# EasyEDA Pro project CAN2RPM-4layer.epro

# Schematic untitled
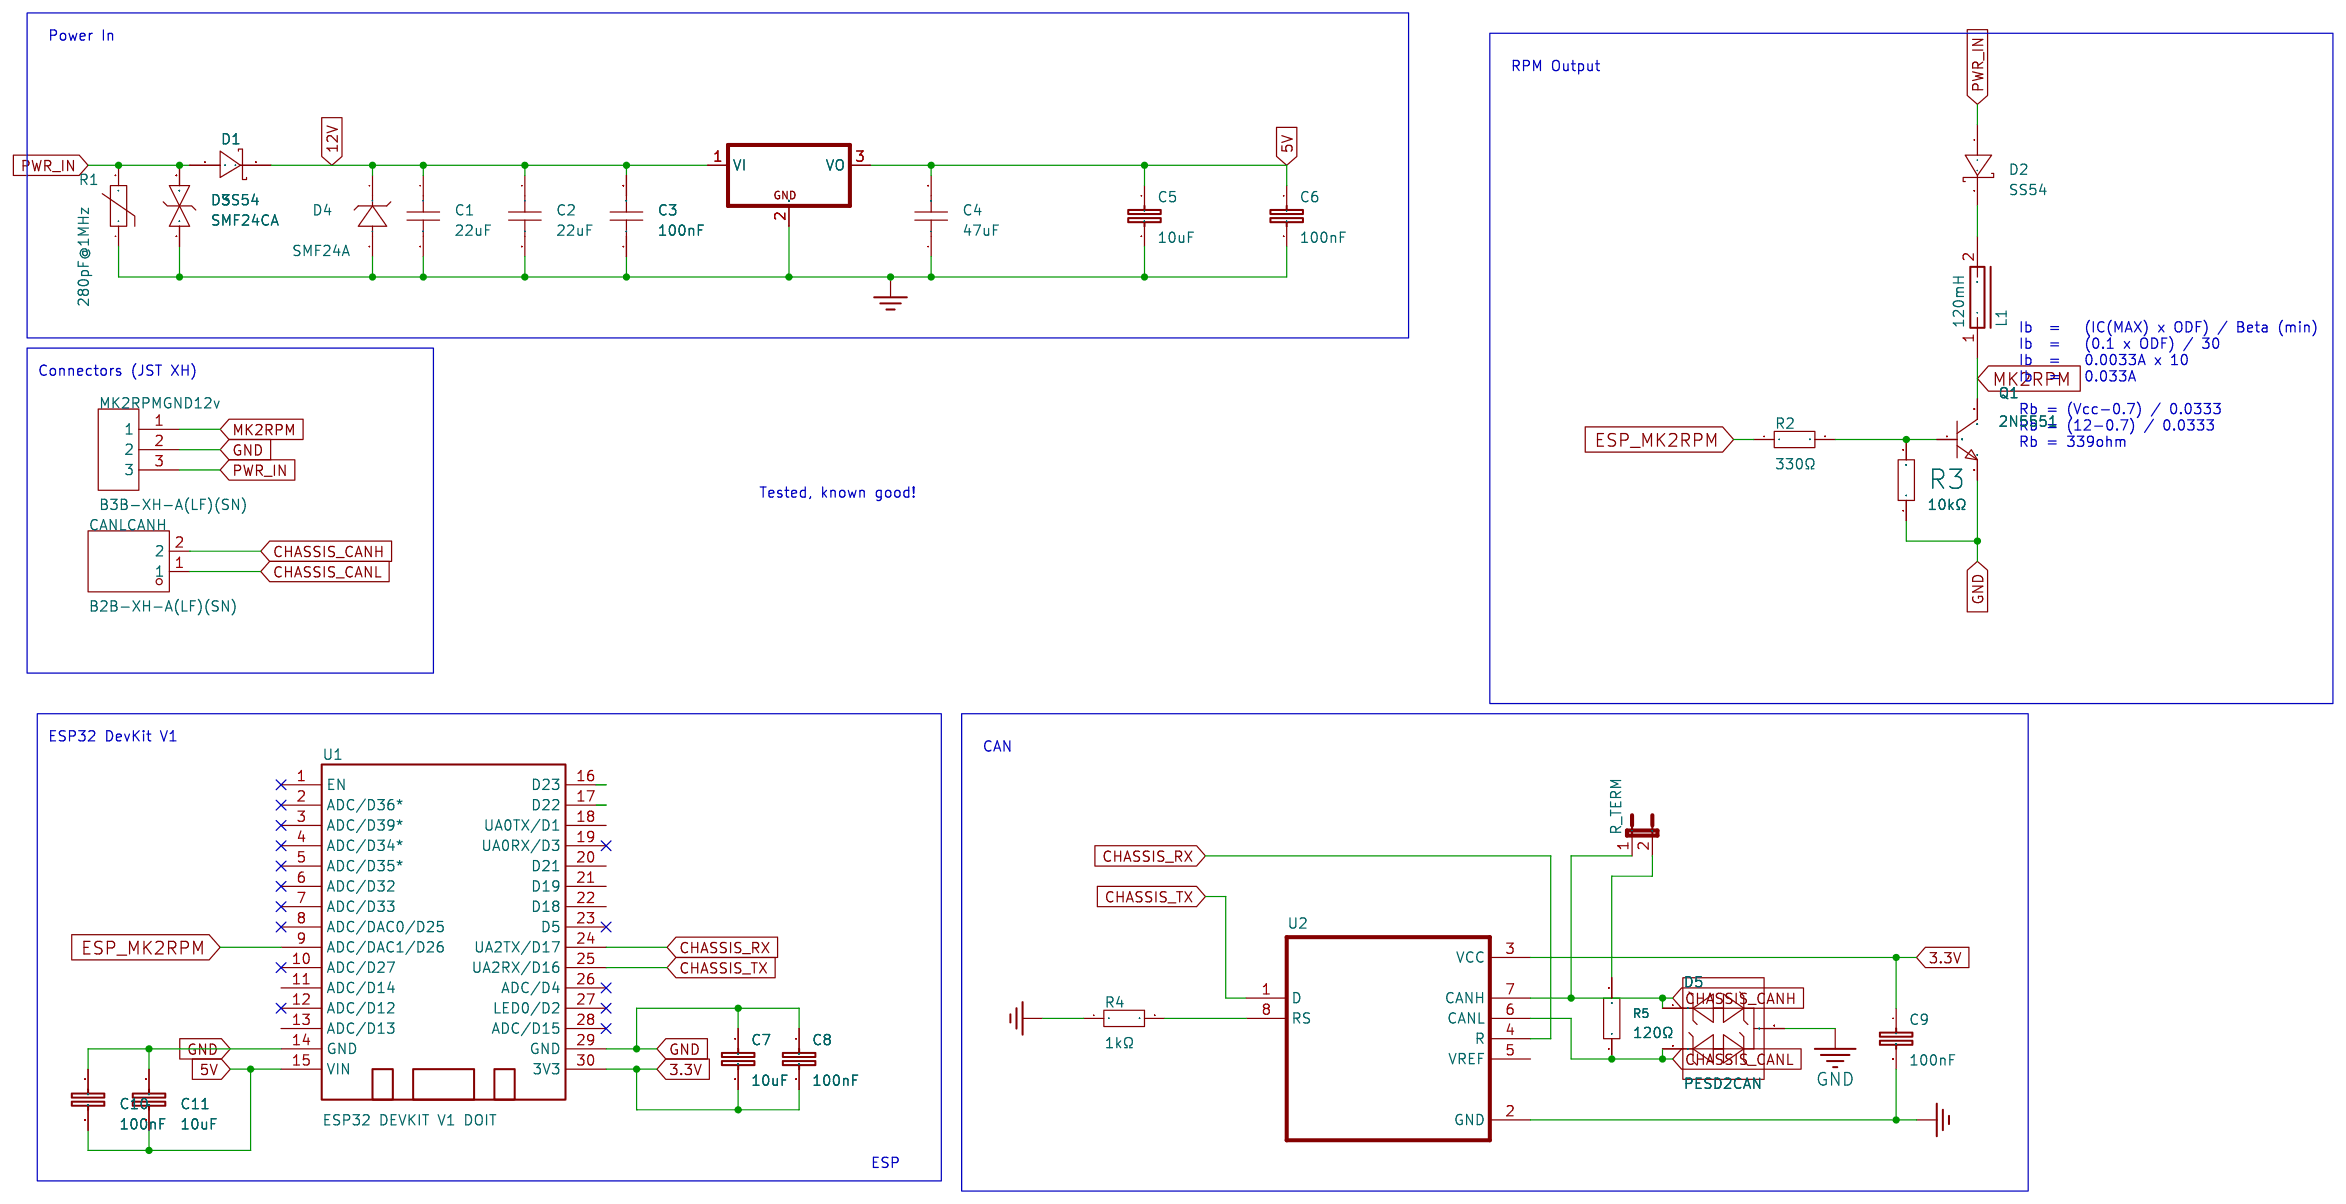
[diagram p0: schematic sheet]

## Parts
C1  22uF  [C0805]
C2  22uF  [C0805]
C3  100nF  [C0603]
C4  47uF  [C0805]
C5  10uF  [C0805]
C6  100nF  [C0805]
C7  10uF  [C0805]
C8  100nF  [C0603]
C9  100nF  [C0805]
C10  100nF  [C0603]
C11  10uF  [C0805]
CANLCANH  B2B-XH-A(LF)(SN)  [CONN-TH_B2B-XH-A-LF-SN]
D1  SS54  [SMA_L4.4-W2.8-LS5.4-R-RD]
D2  SS54  [SMA_L4.4-W2.8-LS5.4-R-RD]
D3  SMF24CA  [SOD-123FL_L2.8-W1.8-LS3.7-BI]
D4  SMF24A  [SOD-123FL_L2.7-W1.8-LS3.8-RD]
D5  PESD2CAN  [SOT-23-3_L2.9-W1.3-P1.90-LS2.4-BR]
IC1  L7805ABD2T-TR  [TO-263-2_L10.0-W9.2-P5.08-LS15.3-TL-CW]
L1  120mH  [IND-SMD_L12.5-W12.5]
MK2RPMGND12v  B3B-XH-A(LF)(SN)  [CONN-TH_3P-P2.50_A2501WV2-3P]
Q1  2N5551  [SOT-23-3_L2.9-W1.4-P1.90-LS2.5-BR]
R1  280pF@1MHz  [R0805]
R2  330Ω  [R0603]
R3  10kΩ  [R0603]
R4  1kΩ  [R0603]
R5  120Ω  [R0603]
R_TERM  PZ254V-11-02P  [HDR-TH_2P-P2.54-V-M]
U1  ESP32 DEVKIT V1 DOIT  [DOIT-ESP32-DEVKIT-V1]
U2  SN65HVD230DR  [SOIC-8_L4.9-W3.9-P1.27-LS6.0-BL]

## Library data of the parts
C1 C2 = HGC0805R5226M350NSLJ: Capacitance: Tolerance:±20% Tolerance:±20% Voltage Rated: Temperature Coefficient:; LCSC Part Name: 22uF ±20% 35V; Supplier Part: C22367832; Manufacturer: Chinocera(华瓷); Supplier Footprint: 0805; JLCPCB Part Class: Extended Part; Datasheet: https://atta.szlcsc.com/upload/public/pdf/source/20240326/E9E9157D170E907C889ABA1F54A94302.pdf; Supplier: LCSC; Tolerance: ±20%; Standardization Check: false
C3 = CL10B104KB8NNNC: Capacitance:100nF Tolerance:±10% Tolerance:±10% Voltage Rating:50V Temperature Coefficient:X7R; LCSC Part Name: 100nF ±10% 50V; Supplier Part: C1591; Manufacturer: SAMSUNG(三星); Supplier Footprint: 0603; JLCPCB Part Class: Extended Part; Datasheet: https://item.szlcsc.com/datasheet/CL10B104KB8NNNC/1943.html; Supplier: LCSC; Tolerance: ±10%; Voltage Rating: 50V; Temperature Coefficient: X7R
C4 = CL21A476MPYNNWE: Capacitance:47uF Tolerance:±20% Tolerance:±20% Voltage Rating:10V Temperature Coefficient:X5R; LCSC Part Name: 47uF ±20% 10V; Supplier Part: C5596752; Manufacturer: SAMSUNG(三星); Supplier Footprint: 0805; JLCPCB Part Class: Extended Part; Datasheet: https://item.szlcsc.com/datasheet/CL21A476MPYNNWE/6515219.html; Supplier: LCSC; Tolerance: ±20%; Voltage Rating: 10V; Temperature Coefficient: X5R
C5 C7 C11 = CL21A106KAYNNNE_C15850: Capacitance: Tolerance:±10% Tolerance:±10% Voltage Rated: Temperature Coefficient:; LCSC Part Name: 10uF ±10% 25V; Supplier Part: C15850; Manufacturer: SAMSUNG(三星); Manufacturer Part: CL21A106KAYNNNE; Supplier Footprint: 0805; JLCPCB Part Class: Basic Part; Datasheet: https://atta.szlcsc.com/upload/public/pdf/source/20160218/1457707763339.pdf; Supplier: LCSC; Tolerance: ±10%
C6 C9 = CT41G-0805-2X1-50V-0.1μF-K(N): Capacitance:100nF Tolerance:±10% Tolerance:±10% Voltage Rating:50V Temperature Coefficient:-; LCSC Part Name: 100nF ±10% 50V; Supplier Part: C126469; Manufacturer: TORCH(火炬); Supplier Footprint: 0805; JLCPCB Part Class: Extended Part; Datasheet: https://atta.szlcsc.com/upload/public/pdf/source/20171225/C150708_15141883600121203188.pdf; Supplier: LCSC; Tolerance: ±10%; Voltage Rating: 50V
C8 C10 = CC0603KRX7R9BB104: Capacitance:100nF Tolerance:±10% Tolerance:±10% Voltage Rating:50V Temperature Coefficient:X7R; LCSC Part Name: 100nF ±10% 50V; Supplier Part: C14663; Manufacturer: YAGEO(国巨); Supplier Footprint: 0603; JLCPCB Part Class: Basic Part; Datasheet: https://atta.szlcsc.com/upload/public/pdf/source/20250214/096C4C206003071F5D32E5F0D8E7F8DF.pdf; Supplier: LCSC; Tolerance: ±10%; Voltage Rating: 50V; Temperature Coefficient: X7R
CANLCANH = B2B-XH-A(LF)(SN): Pins Structure:1x2P Pitch:2.5mm Mounting Style:Direct Insert Reference Series:XH Number of Pins:2P Number of Rows:1 Number of PINs Per Row:2 Row Spacing:- Current Rating (Max):3A Contact Material:Brass Contact Plating:Tin Operating Temperature Range:-25℃~; LCSC Part Name: 1x2P 间距:2.5mm 直插 系列:XH; Supplier Part: C158012; Manufacturer: JST; Supplier Footprint: 插件,P=2.5mm; JLCPCB Part Class: Extended Part; Datasheet: https://atta.szlcsc.com/upload/public/pdf/source/20180928/C265283_F9DFEEBDB2CF642B6BDFAB4B77BD2680.pdf; Supplier: LCSC; Pins Structure: 1x2P; Pitch: 2.5mm; Mounting Style: Direct Insert; Reference Series: XH; Number of Pins: 2P; Number of Rows: 1; Number of PINs Per Row: 2; Current Rating (Max): 3A; Contact Material: Brass; Contact Plating: Tin; Operating Temperature Range: -25℃~+85℃; Rated Voltage (Max): 250V; Plastic Material: PA66; Flame Retardant Rating: UL94V-0; Supplementary Features: K-leg punch; Colour: White; Z-Height of the Board: 7mm; X-Length of Bottom Edge on Board (Spacing Line): 7.4mm; Y-Width of Bottom Edge on Board: 5.75mm
D1 D2 = SS54_C22452: Diode Configuration:Independent Type Forward Voltage (Vf@If):550mV@5A Reverse Voltage (Vr):40V Rectified Current:5A Reverse Leakage Current (Ir):1mA@40V; LCSC Part Name: 电压:40V 电流:5A; Supplier Part: C22452; Manufacturer: MDD(辰达半导体); Supplier Footprint: SMA(DO-214AC); JLCPCB Part Class: Basic Part; Datasheet: https://atta.szlcsc.com/upload/public/pdf/source/20240710/73DFBB65C1883B895E62D589679033DF.pdf; Supplier: LCSC; Diode Configuration: Independent Type; Forward Voltage (Vf@If): 550mV@5A; Reverse Voltage (Vr): 40V; Rectified Current: 5A; Reverse Leakage Current (Ir): 1mA@40V
D3 = SMF24CA_C353294: Reverse Stand-Off Voltage (Vrwm):24V Maximum Clamping Voltage:38.9V Peak Pulse Current (Ipp)@10/1000us:5.1A Breakdown Voltage:26.7V Reverse Leakage Current (Ir):1uA Type:TVS; Supplier Part: C353294; Manufacturer: 晶导微电子; Supplier Footprint: SOD-123FL; JLCPCB Part Class: Extended Part; Datasheet: https://atta.szlcsc.com/upload/public/pdf/source/20201106/C438024_76561727B84E8C9F41A4B4461A8AA838.pdf; Supplier: LCSC; Reverse Stand-Off Voltage (Vrwm): 24V; Maximum Clamping Voltage: 38.9V; Peak Pulse Current (Ipp)@10/1000us: 5.1A; Breakdown Voltage: 26.7V; Reverse Leakage Current (Ir): 1uA; Type: TVS
D4 = SMF24A_C19077514: Polarity:Unidirectional Reverse Stand-Off Voltage (Vrwm):24V Clamping Voltage:38.9V Peak Pulse Current (Ipp):5.1A@10/1000us Peak Pulse Power Dissipation (Ppp):200W@10/1000us Voltage - Breakdown:29.5V Reverse Leakage Current (Ir):1uA Number of Channels:1.0; LCSC Part Name: 单向TVS 24V截止 峰值浪涌电流：5.1A@10/1000us; Supplier Part: C19077514; Manufacturer: R+O(宏嘉诚); Supplier Footprint: SOD-123FL; JLCPCB Part Class: Extended Part; Datasheet: https://item.szlcsc.com/datasheet/SMF24A/20275599.html; Supplier: LCSC; Polarity: Unidirectional; Reverse Stand-Off Voltage (Vrwm): 24V; Clamping Voltage: 38.9V; Peak Pulse Current (Ipp): 5.1A@10/1000us; Peak Pulse Power Dissipation (Ppp): 200W@10/1000us; Voltage - Breakdown: 29.5V; Reverse Leakage Current (Ir): 1uA; Number of Channels: 1; Operating Temperature: -55℃~+150℃; level of protection: IEC 61000-4-2; Type: TVS
D5 = PESD2CAN_C907830: Polarity:Bidirectional Reverse Stand-Off Voltage (Vrwm):24V Clamping Voltage:50V Peak Pulse Current (Ipp):5.5A@8/20us Peak Pulse Power Dissipation (Ppp):250W@8/20us Voltage - Breakdown:32V Reverse Leakage Current (Ir):80nA Number of Channels:2 Operating T; LCSC Part Name: 丝印为6Rt 双向ESD 24V截止 峰值浪涌电流：5.5A@8/20us; Supplier Part: C907830; Manufacturer: TECH PUBLIC(台舟); Supplier Footprint: SOT-23; JLCPCB Part Class: Extended Part; Datasheet: https://item.szlcsc.com/datasheet/PESD2CAN/973917.html; Supplier: LCSC; Polarity: Bidirectional; Reverse Stand-Off Voltage (Vrwm): 24V; Clamping Voltage: 50V; Peak Pulse Current (Ipp): 5.5A@8/20us; Peak Pulse Power Dissipation (Ppp): 250W@8/20us; Voltage - Breakdown: 32V; Reverse Leakage Current (Ir): 80nA; Number of Channels: 2; Operating Temperature: -55℃~+125℃; level of protection: IEC 61000-4-2；IEC 61000-4-4；IEC 61000-4-5; Type: ESD; Junction Capacitance: 17pF
IC1 = L7805ABD2T-TR: Output Type:Fixed Maximum Input Voltage:35V Output Voltage:5V Output Voltage:5V Output Current:1.5A Power Supply Rejection Ratio (PSRR):68dB@(120Hz) Dropout Voltage:2V@(1A) standby current:6mA Feature:Short-Circuit  Protection；Thermal Protection(TSD) Oper; LCSC Part Name: 正稳压器IC; Supplier Part: C86206; Manufacturer: ST(意法半导体); Supplier Footprint: TO-263-2; JLCPCB Part Class: Extended Part; Datasheet: https://atta.szlcsc.com/upload/public/pdf/source/20191219/C472632_C0855675BBC73B8C8E44EE1325AAD56A.pdf; Supplier: LCSC; Output Type: Fixed; Maximum Input Voltage: 35V; Output Voltage: 5V; Output Current: 1.5A; Power Supply Rejection Ratio (PSRR): 68dB@(120Hz); Dropout Voltage: 2V@(1A); standby current: 6mA; Feature: Short-Circuit  Protection；Thermal Protection(TSD); Operating Temperature: -40℃~+125℃; Output Polarity: Positive electrode; Number of Outputs: 1
L1 = DR125-124-R: Inductance:120mH Tolerance:±20% Tolerance:±20% Current Rating:60mA Current - Saturation(Isat):69mA DC Resistance(DCR):150Ω Type:- Ratings:-; LCSC Part Name: 120mH ±20% 69mA; Supplier Part: C2453120; Manufacturer: EATON(伊顿); Supplier Footprint: SMD,12.5x12.5mm; JLCPCB Part Class: Extended Part; Datasheet: https://atta.szlcsc.com/upload/public/pdf/source/20210417/1890D5F29C45E96B4D8E6D27BBAB5A55.pdf; Supplier: LCSC; Tolerance: ±20%; Current Rating: 60mA; Current - Saturation(Isat): 69mA; DC Resistance(DCR): 150Ω
MK2RPMGND12v = B3B-XH-A(LF)(SN): Pins Structure:1x3P Pitch:2.5mm Mounting Style:Direct Insert Reference Series:XH Number of Pins:3P Number of Rows:1 Number of PINs Per Row:3 Row Spacing:- Current Rating (Max):3A Contact Material:Brass Contact Plating:Tin Operating Temperature Range:-25℃~; LCSC Part Name: 1x3P 间距:2.5mm 直插 系列:XH; Supplier Part: C144394; Manufacturer: JST; Supplier Footprint: 插件,P=2.5mm; JLCPCB Part Class: Extended Part; Datasheet: https://atta.szlcsc.com/upload/public/pdf/source/20180928/C265283_F9DFEEBDB2CF642B6BDFAB4B77BD2680.pdf; Supplier: LCSC; Pins Structure: 1x3P; Pitch: 2.5mm; Mounting Style: Direct Insert; Reference Series: XH; Number of Pins: 3P; Number of Rows: 1; Number of PINs Per Row: 3; Current Rating (Max): 3A; Contact Material: Brass; Contact Plating: Tin; Operating Temperature Range: -25℃~+85℃; Rated Voltage (Max): 250V; Plastic Material: PA66; Flame Retardant Rating: UL94V-0; Supplementary Features: K-leg punch; Colour: White; Z-Height of the Board: 7mm; X-Length of Bottom Edge on Board (Spacing Line): 9.9mm; Y-Width of Bottom Edge on Board: 5.75mm
Q1 = 2N5551_C7529570: Transistor Type: Collector Current (Ic): Collector-Emitter Breakdown Voltage (Vceo): Power Dissipation (Pd):625mW DC Current Gain (hFE@Ic,Vce):80@10mA,5V DC Current Gain (hFE@Ic,Vce):80@10mA,5V Transition Frequency (fT):80MHz Collector Cut-Off Current (Ic; LCSC Part Name: NPN 电流:1A 耐压:160V; Supplier Part: C7529570; Manufacturer: RUILON(瑞隆源); Supplier Footprint: SOT-23; JLCPCB Part Class: Extended Part; Datasheet: https://atta.szlcsc.com/upload/public/pdf/source/20231206/D621ADD1802AEB70BE68282CC20D67DB.pdf; Supplier: LCSC; Power Dissipation (Pd): 625mW; DC Current Gain (hFE@Ic,Vce): 80@10mA,5V; Transition Frequency (fT): 80MHz; Collector Cut-Off Current (Icbo): 100nA; Collector-Emitter Saturation Voltage (VCE(sat)@Ic,Ib): 500mV@50mA,5mA; Operating Temperature: -55℃~+150℃
R1 = FPV201209E260PKT: Varistor Voltage:36V Varistor Voltage:36V Clamping Voltage:63V Maximum DC Volts:26V Maximum AC Volts:18.4V Peak Current:100A Energy:0.3J Energy:0.3J Capacitance:280pF@1MHz Rated Wattage:-; LCSC Part Name: 钳位电压63V 0.3焦耳 0805压敏电阻; Supplier Part: C2991545; Manufacturer: FH(风华); Supplier Footprint: 0805; JLCPCB Part Class: Extended Part; Datasheet: https://atta.szlcsc.com/upload/public/pdf/source/20181030/C304296_DDDABF933F96CAF6D0EBDDE0D30269D0.pdf; Supplier: LCSC; Varistor Voltage: 36V; Clamping Voltage: 63V; Maximum DC Volts: 26V; Maximum AC Volts: 18.4V; Peak Current: 100A; Energy: 0.3J
R2 = 0603WAF3300T5E: Type:Thick Film Resistors Resistance: Tolerance:±1% Tolerance:±1% Power(Watts): Overload Voltage (Max): Temperature Coefficient:±100ppm/℃ Temperature Coefficient:±100ppm/℃ Operating Temperature Range:-55℃~+155℃ Operating Temperature Range:-55℃~+155℃; LCSC Part Name: 330Ω ±1% 100mW 厚膜电阻; Supplier Part: C23138; Manufacturer: UNI-ROYAL(厚声); Supplier Footprint: 0603; JLCPCB Part Class: Basic Part; Datasheet: https://atta.szlcsc.com/upload/public/pdf/source/20200306/C422600_1E6D84923E4A46A82E41ADD87F860B5C.pdf; Supplier: LCSC; Type: Thick Film Resistors; Tolerance: ±1%; Temperature Coefficient: ±100ppm/℃; Operating Temperature Range: -55℃~+155℃
R3 = 0603WAF1002T5E: Type:Thick Film Resistor Resistance:10kΩ Tolerance:±1% Tolerance:±1% Power(Watts):100mW Voltage-Supply(Max):75V Temperature Coefficient:±100ppm/℃ Temperature Coefficient:±100ppm/℃ Operating Temperature:-55℃~+155℃ Operating Temperature:-55℃~+155℃; LCSC Part Name: 厚膜电阻 10kΩ ±1% 100mW; Supplier Part: C25804; Manufacturer: UNI-ROYAL(厚声); Supplier Footprint: 0603; JLCPCB Part Class: Basic Part; Datasheet: https://atta.szlcsc.com/upload/public/pdf/source/20200306/C422600_1E6D84923E4A46A82E41ADD87F860B5C.pdf; Supplier: LCSC; Type: Thick Film Resistor; Tolerance: ±1%; Power(Watts): 100mW; Voltage-Supply(Max): 75V; Temperature Coefficient: ±100ppm/℃; Operating Temperature: -55℃~+155℃
R4 = 0603WAF1001T5E: Type:Thick Film Resistors Resistance:1kΩ Tolerance:±1% Tolerance:±1% Power(Watts): Overload Voltage (Max): Temperature Coefficient:±100ppm/℃ Temperature Coefficient:±100ppm/℃ Operating Temperature Range:-55℃~+155℃ Operating Temperature Range:-55℃~+155℃; LCSC Part Name: 1kΩ ±1% 100mW 厚膜电阻; Supplier Part: C21190; Manufacturer: UNI-ROYAL(厚声); Supplier Footprint: 0603; JLCPCB Part Class: Basic Part; Datasheet: https://atta.szlcsc.com/upload/public/pdf/source/20200306/C422600_1E6D84923E4A46A82E41ADD87F860B5C.pdf; Supplier: LCSC; Type: Thick Film Resistors; Tolerance: ±1%; Temperature Coefficient: ±100ppm/℃; Operating Temperature Range: -55℃~+155℃
R5 = 0603WAF1200T5E: Type:Thick Film Resistors Resistance: Tolerance:±1% Tolerance:±1% Power(Watts): Overload Voltage (Max): Temperature Coefficient:±100ppm/℃ Temperature Coefficient:±100ppm/℃ Operating Temperature Range:-55℃~+155℃ Operating Temperature Range:-55℃~+155℃; LCSC Part Name: 120Ω ±1% 100mW 厚膜电阻; Supplier Part: C22787; Manufacturer: UNI-ROYAL(厚声); Supplier Footprint: 0603; JLCPCB Part Class: Basic Part; Datasheet: https://atta.szlcsc.com/upload/public/pdf/source/20200306/C422600_1E6D84923E4A46A82E41ADD87F860B5C.pdf; Supplier: LCSC; Type: Thick Film Resistors; Tolerance: ±1%; Temperature Coefficient: ±100ppm/℃; Operating Temperature Range: -55℃~+155℃
R_TERM = PZ254V-11-02P: Pin Structure:1x2P Pitch:2.54mm Row Spacing:- Circluar Pins/Square Pins:Policy Mounting Type:Straight Number of Rows:Single Row Number of Pins:2P Current Rating:- Voltage Rating (Max):- Length of Mating Pin:6mm Insulation Height:2.5mm Length of End Connec; LCSC Part Name: 1x2P 间距:2.54mm 方针 直插; Supplier Part: C492401; Manufacturer: XFCN(兴飞); Supplier Footprint: 插件,P=2.54mm; JLCPCB Part Class: Extended Part; Datasheet: https://atta.szlcsc.com/upload/public/pdf/source/20200309/C492401_A812433581A9B211A7FFA413ADDFF0E5.pdf; Supplier: LCSC; Pin Structure: 1x2P; Pitch: 2.54mm; Circluar Pins/Square Pins: Policy; Mounting Type: Straight; Number of Rows: Single Row; Number of Pins: 2P; Length of Mating Pin: 6mm; Insulation Height: 2.5mm; Length of End Connection Pin: 3mm; Contact Material: Brass; Operating Temperature: -40℃~+105℃; Color: Black
U1 = ESP32 DEVKIT V1 DOIT
U2 = SN65HVD230DR: Type:CANtransceiver Data Rate:1Mbps Voltage - Supply:- Voltage - Supply:- Current - Supply:- Operating Temperature:-40℃~+85℃ Operating Temperature:-40℃~+85℃; LCSC Part Name: 3.3-V CAN 收发器; Supplier Part: C12084; Manufacturer: TI(德州仪器); Supplier Footprint: SOIC-8; JLCPCB Part Class: Extended Part; Datasheet: https://www.ti.com/cn/lit/gpn/sn65hvd230; Supplier: LCSC; Type: CANtransceiver; Data Rate: 1Mbps; Operating Temperature: -40℃~+85℃

## Nets
3.3V: C7.2 C8.2 C9.1 U1.30(3V3) U2.3(VCC)
5V: C4.2 C5.1 C6.1 C10.1 C11.1 IC1.3(VO) U1.15(VIN)
12V: C1.1 C2.1 C3.2 D1.2(K) D4.1(K) IC1.1(VI)
GND: C1.2 C2.2 C3.1 C4.1 C5.2 C6.2 C7.1 C8.1 C9.2 C10.2 C11.2 D3.1 D4.2(A) D5.3 IC1.2(GND) MK2RPMGND12v.2 Q1.2(E) R1.1 R3.1 R4.1 U1.14(GND) U1.29(GND) U2.2(GND)
CHASSIS_CANH: CANLCANH.2 D5.1 R_TERM.1 U2.7(CANH)
CHASSIS_CANL: CANLCANH.1 D5.2 R5.1 U2.6(CANL)
CHASSIS_RX: U1.24(UA2TX/D17) U2.4(R)
CHASSIS_TX: U1.25(UA2RX/D16) U2.1(D)
ESP_MK2RPM: R2.1 U1.9(ADC/DAC1/D26)
MK2RPM: L1.1 MK2RPMGND12v.1 Q1.3(C)
PWR_IN: D1.1(A) D2.1(A) D3.2 MK2RPMGND12v.3 R1.2
$1N3923: R4.2 U2.8(RS)
$1N3947: R5.2 R_TERM.2
$1N4153: Q1.1(B) R2.2 R3.2
$1N4157: D2.2(K) L1.2

Not connected (* = marked no-connect by the designer): U1 1(EN)* 2(ADC/D36*)* 3(ADC/D39*)* 4(ADC/D34*)* 5(ADC/D35*)* 6(ADC/D32)* 7(ADC/D33)* 8(ADC/DAC0/D25)* 10(ADC/D27)* 11(ADC/D14) 12(ADC/D12)* 13(ADC/D13) 16(D23) 17(D22) 18(UA0TX/D1) 19(UA0RX/D3)* 20(D21) 21(D19) 22(D18) 23(D5)* 26(ADC/D4)* 27(LED0/D2)* 28(ADC/D15)*; U2 5(VREF)

## Notes on the sheet
- Power In
- RPM Output
- Connectors (JST XH)
- Ib  =   (IC(MAX) x ODF) / Beta (min)
  Ib  =   (0.1 x ODF) / 30
  Ib  =   0.0033A x 10
  Ib  =   0.033A
  Rb = (Vcc-0.7) / 0.0333
  Rb = (12-0.7) / 0.0333
  Rb = 339ohm
- Tested, known good!
- ESP32 DevKit V1
- CAN
- ESP

# Board untitled
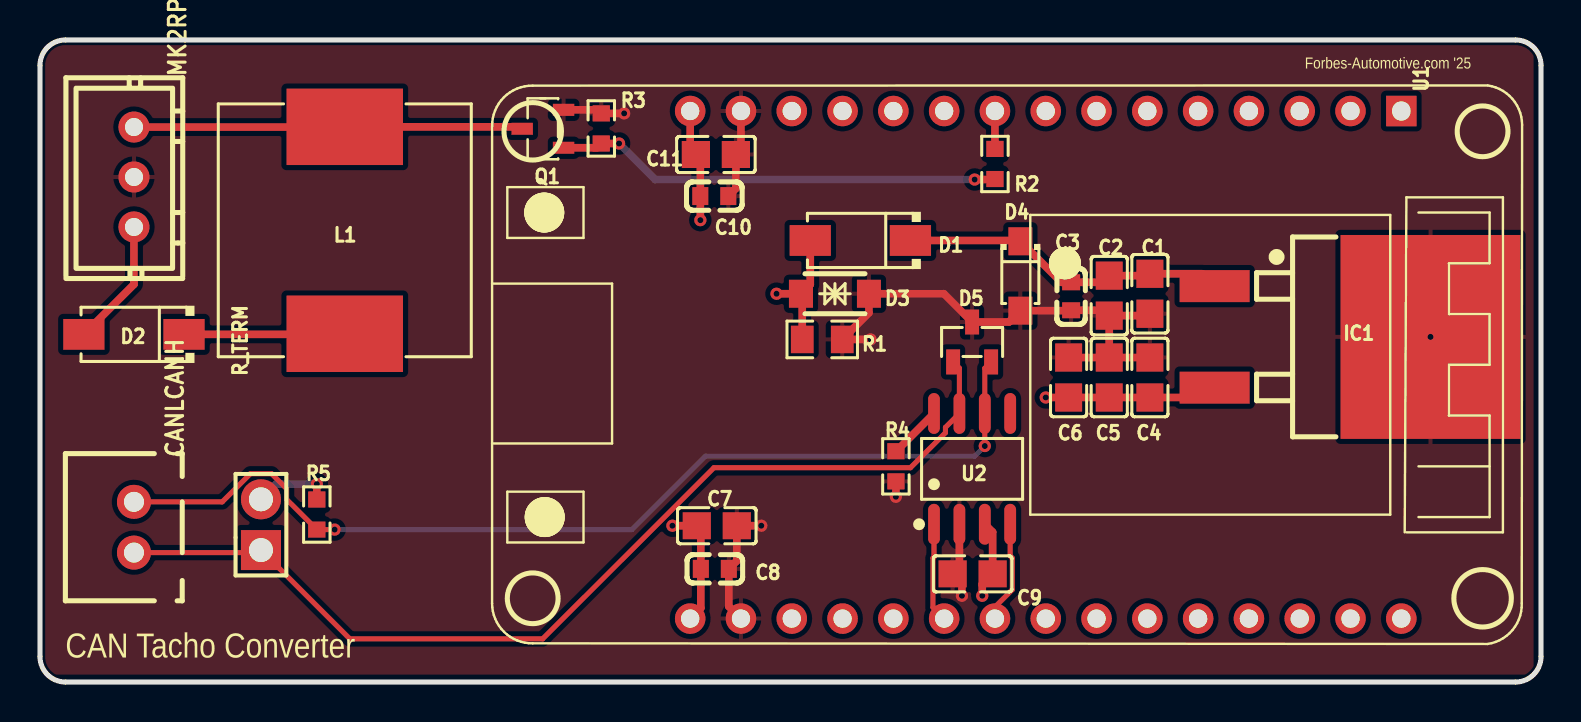
[diagram p1: board, top side]
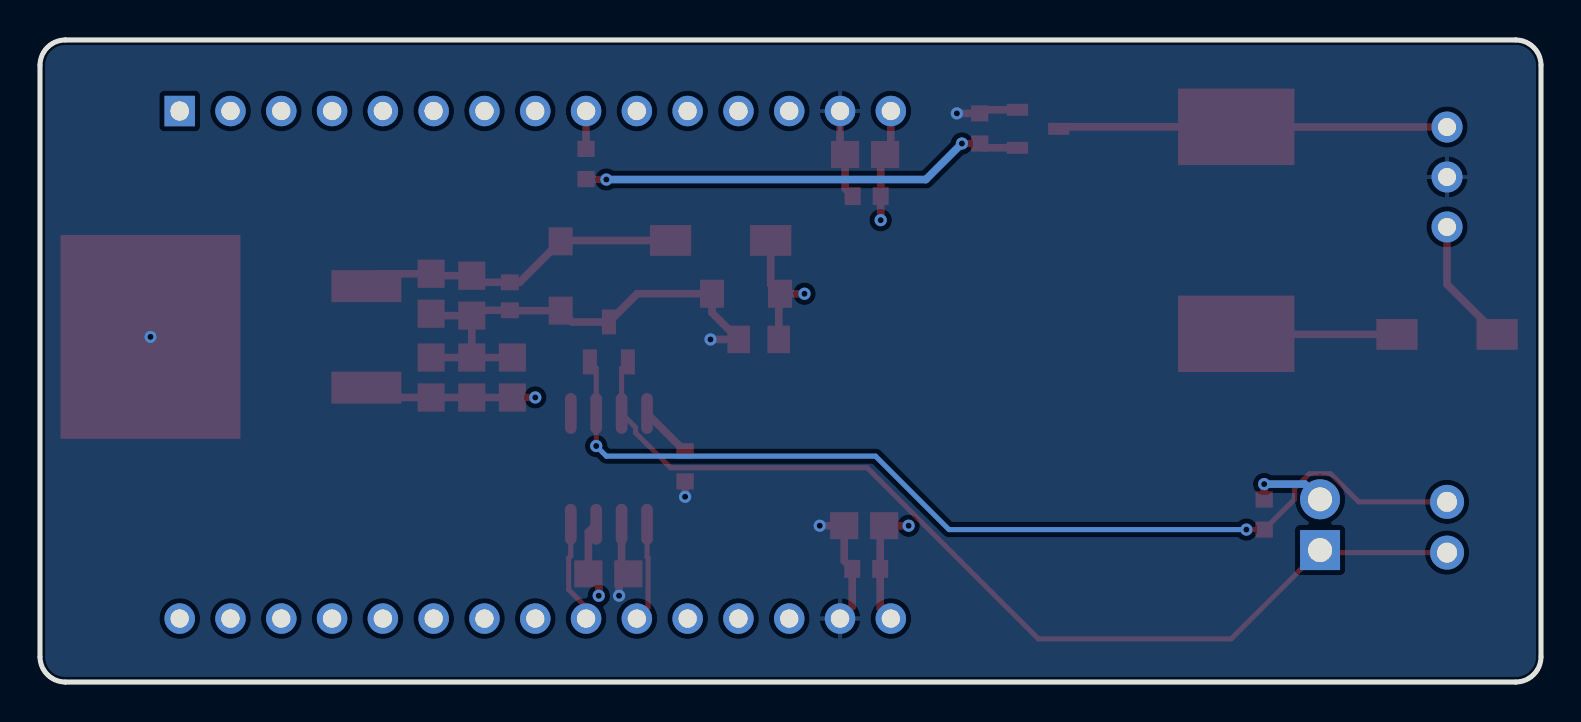
[diagram p2: board, bottom side, seen from below]

Outline 75.06 x 32.13 mm; copper layers: Top Layer, Power, Ground, Bottom Layer. Coordinates in mm from the lower left corner of the outline.
Outline path: 0,30.86 0,1.27 arc(0.37,0.37) 1.27,0 73.79,0 arc(74.69,0.37) 75.06,1.27 75.06,30.86 arc(74.69,31.76) 73.79,32.13 1.27,32.13 arc(0.37,31.76) 0,30.86
Stack: Top Layer 0.035mm Outer layer thickness 1oz / Dielectric1 0.2104mm 7628 RC49% 8.6mil / Power 0.0152mm Inner layer thickness / Dielectric2 1.065mm 1.1mm H/HOZ Copper / Ground 0.0152mm Inner layer thickness / Dielectric3 0.2104mm 7628 RC49% 8.6mil / Bottom Layer 0.035mm Outer layer thickness 1oz

## Design rules (mm)
net CHASSIS_CANH: DP1
net CHASSIS_CANL: DP1
net CHASSIS_RX: DP2
net CHASSIS_TX: DP2
template: User Custom Config
spacing safeClearance (default): track to track 0.102, other pairs 0.152 to 0.3
track width trackWidth: min 0.457, default 0.457, max 2.54
track width default (default): min 0.305, default 0.381, max 2.54
differential pair differentialPair (default): width min 0.127, default 0.254, max 2.54; gap min 0.152, default 0.152
via viaSize: diameter min 0.35, default 0.35, max 2.6; hole min 0.35, default 0.35, max 2
via default (default): diameter min 0.5, default 0.61, max 10; hole min 0.3, default 0.305, max 6.3

## Placement (name value [footprint] x y rotation side)
C1  22uF  [C0805]  55.5 19.43 270 top
C2  22uF  [C0805]  53.47 19.34 270 top
C3  100nF  [C0603]  51.56 19.3 90 top
C4  47uF  [C0805]  55.5 15.24 270 top
C5  10uF  [C0805]  53.47 15.24 90 top
C6  100nF  [C0805]  51.44 15.24 90 top
C7  10uF  [C0805]  33.84 7.82 180 top
C8  100nF  [C0603]  33.74 5.66 180 top
C9  100nF  [C0805]  46.64 5.41 180 top
C10  100nF  [C0603]  33.72 24.32 0 top
C11  10uF  [C0805]  33.8 26.4 0 top
CANLCANH  B2B-XH-A(LF)(SN)  [CONN-TH_B2B-XH-A-LF-SN]  4.7 7.75 90 top
D1  SS54  [SMA_L4.4-W2.8-LS5.4-R-RD]  41.02 22.1 180 top
D2  SS54  [SMA_L4.4-W2.8-LS5.4-R-RD]  4.7 17.4 180 top
D3  SMF24CA  [SOD-123FL_L2.8-W1.8-LS3.7-BI]  39.75 19.43 180 top
D4  SMF24A  [SOD-123FL_L2.7-W1.8-LS3.8-RD]  49.02 20.32 270 top
D5  PESD2CAN  [SOT-23-3_L2.9-W1.3-P1.90-LS2.4-BR]  46.61 17.02 270 top
IC1  L7805ABD2T-TR  [TO-263-2_L10.0-W9.2-P5.08-LS15.3-TL-CW]  64.13 17.27 0 top
L1  120mH  [IND-SMD_L12.5-W12.5]  15.24 22.61 90 top
MK2RPMGND12v  B3B-XH-A(LF)(SN)  [CONN-TH_3P-P2.50_A2501WV2-3P]  4.7 25.27 270 top
Q1  2N5551  [SOT-23-3_L2.9-W1.4-P1.90-LS2.5-BR]  25.15 27.69 0 top
R1  280pF@1MHz  [R0805]  39.12 17.14 180 top
R2  330Ω  [R0603]  47.75 25.93 270 top
R3  10kΩ  [R0603]  28.07 27.7 270 top
R4  1kΩ  [R0603]  42.8 10.8 90 top
R5  120Ω  [R0603]  13.84 8.38 90 top
R_TERM  PZ254V-11-02P  [HDR-TH_2P-P2.54-V-M]  11.05 7.87 90 top
U1  ESP32 DEVKIT V1 DOIT  [DOIT-ESP32-DEVKIT-V1]  68.07 28.57 270 top
U2  SN65HVD230DR  [SOIC-8_L4.9-W3.9-P1.27-LS6.0-BL]  46.61 10.67 0 top

## Footprints (pads in the part's own frame, mm; a bottom-side part is the same pattern mirrored in y, then rotated)
C0603
  rect 0.8x0.9 smd: 1(-0.7,0) 2(0.7,0)
C0805
  rect 1.41x1.35 smd: 1(-1,0) 2(1,0)
CONN-TH_3P-P2.50_A2501WV2-3P
  round 1.55 hole 0.9: 1(-2.5,0) 2(0,0) 3(2.5,0)
CONN-TH_B2B-XH-A-LF-SN
  round 1.7 hole 1: 1(1.27,0) 2(-1.27,0)
DOIT-ESP32-DEVKIT-V1
  rect 1.524x1.524 hole 0.96x0.914: 1(0,0)
  round 1.524 hole 0.914: 2(0,-2.54) 3(0,-5.08) 4(0,-7.62) 5(0,-10.16) 6(0,-12.7) 7(0,-15.24) 8(0,-17.78) 9(0,-20.32) 10(0,-22.86) 11(0,-25.4) 12(0,-27.94) 13(0,-30.48) 14(0,-33.02) 15(0,-35.56) 16(25.4,0) 17(25.4,-2.54) 18(25.4,-5.08) 19(25.4,-7.62) 20(25.4,-10.16) 21(25.4,-12.7) 22(25.4,-15.24) 23(25.4,-17.78) 24(25.4,-20.32) 25(25.4,-22.86) 26(25.4,-25.4) 27(25.4,-27.94) 28(25.4,-30.48) 29(25.4,-33.02) 30(25.4,-35.56)
HDR-TH_2P-P2.54-V-M
  rect 2x2 hole 1.2: 1(-1.27,0)
  round 2 hole 1.2: 2(1.27,0)
IND-SMD_L12.5-W12.5
  rect 3.824x5.82 smd: 1(5.178,0) 2(-5.178,0)
R0603
  rect 0.806x0.864 smd: 1(-0.753,0) 2(0.753,0)
R0805
  rect 1.133x1.377 smd: 1(-1,0) 2(1,0)
SMA_L4.4-W2.8-LS5.4-R-RD
  rect 2.062x1.539 smd: 1(2.503,0) 2(-2.503,0)
SOD-123FL_L2.7-W1.8-LS3.8-RD
  rect 1.4x1.2 smd: 1(-1.735,0) 2(1.735,0)
SOD-123FL_L2.8-W1.8-LS3.7-BI
  rect 1.2x1.4 smd: 1(-1.7,0) 2(1.7,0)
SOIC-8_L4.9-W3.9-P1.27-LS6.0-BL
  oval 0.588x2.045 smd: 1(-1.905,-2.772) 2(-0.635,-2.772) 3(0.635,-2.772) 4(1.905,-2.772) 5(1.905,2.772) 6(0.635,2.772) 7(-0.635,2.772) 8(-1.905,2.772)
SOT-23-3_L2.9-W1.3-P1.90-LS2.4-BR
  rect 1.25x0.7 smd: 1(1,-0.95) 2(1,0.95) 3(-1,0)
SOT-23-3_L2.9-W1.4-P1.90-LS2.5-BR
  rect 1.07x0.6 smd: 1(1.035,-0.95) 2(1.035,0.95) 3(-1.035,0)
TO-263-2_L10.0-W9.2-P5.08-LS15.3-TL-CW
  rect 3.5x1.6 smd: 1(-5.397,2.54) 3(-5.397,-2.54)
  rect 9x10.2 smd: 2(5.397,0)

## Nets
As in the schematic.

Pads without a net: U1 1 2 3 4 5 6 7 8 10 11 12 13 18 19 20 21 22 23 26 27 28; U2 5

## Via types
v1: diameter 0.61, hole 0.305, Top Layer to Bottom Layer, 16 vias

## Routing (per net, layer and track width the routed paths; a pad name or vN(x,y) marks a point on that pad's centre or on a via; arc(x,y) is an arc through that point)
3.3V: length 27.6
  Top Layer w0.381: U2.3 47.64,7.5 C9.1 47.12,4.89 v1(47.12,4.32) ; v1(31.62,7.82) C7.2 33.04,7.62 C8.2 33.04,3.71 U1.30
  Power w0.381: v1(31.62,7.82) 35.13,4.32 45.19,4.32 45.83,4.97 46.37,4.97 47.02,4.32 v1(47.12,4.32)
5V: length 35.9
  Top Layer w0.381: v1(33.02,23.11) C10.1 33.02,26.18 C11.1 32.51,26.69 U1.15 ; IC1.3 58.25,14.24 C4.2 C5.1 C6.1 v1(50.29,14.24)
  Power w0.381: v1(33.02,23.11) 36.06,20.08 37.1,20.08 37.48,19.7 37.48,18.66 41.89,14.24 v1(50.29,14.24)
12V: length 16.5
  Top Layer w0.381: IC1.1 58.12,20.43 C1.1 55.4,20.34 C2.1 53.13,20 51.07,20 D4.1 48.98,22.1 D1.2
GND: length 44
  Top Layer w0.381: v1(41.53,17.14) R1.1 41.45,18.48 D3.1 45.2,19.43 D5.3 48.46,18.02 D4.2 51.54,18.58 C3.1 53.2,18.6 C2.2 ; v1(36.07,7.82) C7.1 34.84,6.06 C8.1 34.44,3.78 U1.29 ; C2.2 55.4,18.34 C1.2 ; C2.2 C5.2 ; C10.2 34.8,24.7 C11.2 35.05,26.65 U1.14 ; C6.2 C5.2 ; C5.2 C4.1 ; R4.1 v1(42.8,9.27) ; v1(46.1,4.32) 46.1,4.95 C9.2 45.97,5.75 U2.2 ; Q1.2 27.89,28.64 R3.1 v1(29.21,28.46)
  vias: v1(69.53,17.27)
CHASSIS_CANH: length 50.7
  Top Layer w0.254: D5.1 45.97,15.7 U2.7 45.28,12.74 45.28,12.47 43.53,10.72 33.7,10.72 25.13,2.16 15.49,2.16 R_TERM.1 10.92,6.48 CANLCANH.2
CHASSIS_CANL: length 50.7
  Top Layer w0.254: v1(14.73,7.63) R5.1 12.33,9.14 12.33,9.67 11.58,10.42 10.52,10.42 9.11,9.02 CANLCANH.1 ; v1(47.24,11.81) U2.6 47.24,15.7 D5.2
  Bottom Layer w0.254: v1(47.24,11.81) 46.74,11.3 33.27,11.3 29.6,7.63 v1(14.73,7.63)
CHASSIS_RX: length 5.1
  Top Layer w0.254: U2.4 48.51,6.31 48.62,6.2 48.62,4.62 47.75,3.76 U1.24
CHASSIS_TX: length 5
  Top Layer w0.254: U2.1 44.7,6.26 44.65,6.2 44.65,3.73 U1.25
ESP_MK2RPM: length 1.9
  Top Layer w0.381: R2.1 U1.9
MK2RPM: length 19.5
  Top Layer w0.381: Q1.3 24.01,27.78 L1.1 15.23,27.77 MK2RPMGND12v.1
PWR_IN: length 49.5
  Top Layer w0.381: R1.2 38.12,19.37 D3.2 ; D1.1 38.52,19.9 D3.2 ; MK2RPMGND12v.3 4.7,19.9 D2.1 ; D3.2 v1(36.83,19.43)
  Power w0.381: v1(36.83,19.43) 33.02,15.62 11.85,15.62 MK2RPMGND12v.3
$1N3923: length 2.7
  Top Layer w0.381: U2.8 42.81,11.55 R4.2
$1N3947: length 3.9
  Top Layer w0.381: R5.2 v1(13.84,9.91)
  Bottom Layer w0.381: v1(13.84,9.91) 11.81,9.91 R_TERM.2
$1N4153: length 22.4
  Top Layer w0.381: Q1.1 27.85,26.74 R3.2 v1(28.96,26.95) ; v1(46.74,25.15) 47.73,25.15 R2.2
  Bottom Layer w0.381: v1(46.74,25.15) 30.76,25.15 v1(28.96,26.95)
$1N4157: length 8
  Top Layer w0.381: D2.2 15.21,17.4 L1.2

## Copper pours and planes (outline as drawn; the poured copper is in the pictures)
GND on Top Layer: -0.13,32.38 74.69,32.38 74.69,0.37 -0.13,0.37
GND on Bottom Layer: -0.13,32.51 74.69,32.51 74.69,0.37 -0.13,0.37
GND on Bottom Layer: 0,32.13 75.06,32.13 75.06,0 0,0
GND on Power: -0.13,32.38 74.69,32.38 74.69,0 -0.13,0
GND on Ground: -0.25,32.26 75.06,32.26 75.06,0.37 -0.25,0.37

## Text on the board
Top Silkscreen Layer: Forbes-Automotive.com '25 | CAN Tacho Converter
